# EAGLE design level-shift rpi-atmel (EAGLE 6.4)
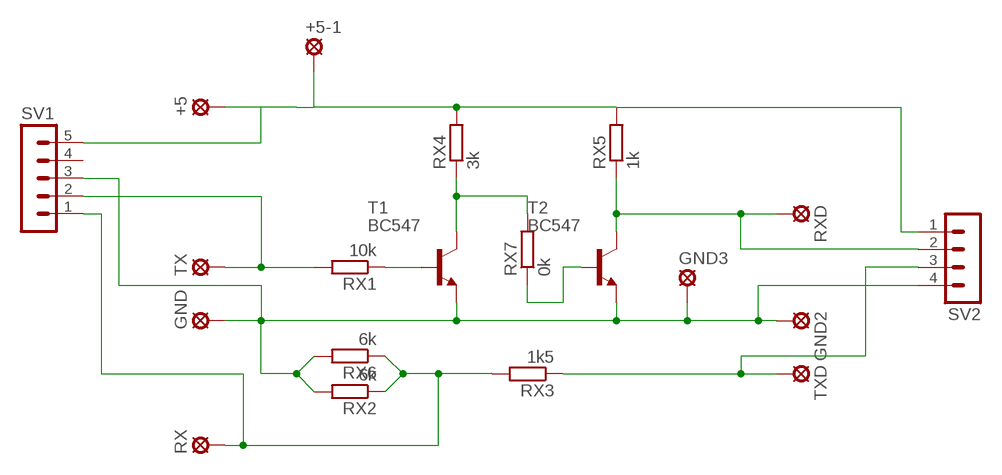
[diagram p0: schematic, sheet 1]

## Parts
+5  LSP10  [LSP10]
+5-1  LSP10  [LSP10]
GND  LSP10  [LSP10]
GND2  LSP10  [LSP10]
GND3  LSP10  [LSP10]
RX  LSP10  [LSP10]
RX1  10k  R-EU_0204/5  [0204/5]
RX2  6k  R-EU_0207/5V  [0207/5V]
RX3  1k5  R-EU_0207/5V  [0207/5V]
RX4  3k  R-EU_0207/7  [0207/7]
RX5  1k  R-EU_0204/7  [0204/7]
RX6  6k  R-EU_0207/5V  [0207/5V]
RX7  0k  R-EU_0204/5  [0204/5]
RXD  LSP10  [LSP10]
SV1  MA05-1  [MA05-1]
SV2  MA04-1  [MA04-1]
T1  BC547  [TO92]
T2  BC547  [TO92]
TX  LSP10  [LSP10]
TXD  LSP10  [LSP10]

## Nets
N$1: RX1.1 T1.2(B)
N$2: RX7.1 T2.2(B)
N$3: RX5.1 RXD.MP SV2.2 T2.3(C)
N$4: RX4.1 RX7.2 T1.3(C)
N$5: GND2.MP GND3.MP GND.MP RX2.2 RX6.2 SV1.3 SV2.4 T1.1(E) T2.1(E)
N$6: RX2.1 RX3.2 RX6.1 RX.MP SV1.1
N$7: +5-1.MP +5.MP RX4.2 RX5.2 SV1.5 SV2.1
N$9: RX1.2 SV1.2 TX.MP
N$11: RX3.1 SV2.3 TXD.MP
Unconnected: SV1.4

## Library data of the parts
+5 +5-1 GND GND2 GND3 RX RXD TX TXD = solpad:LSP10: SOLDER PAD drill 1.0 mm, distributor Buerklin, 12H555
RX1-RX7 = rcl:R-EU_: RESISTOR, European symbol
SV1 = con-lstb:MA05-1: PIN HEADER; OC_FARNELL: unknown; OC_NEWARK: unknown
SV2 = con-lstb:MA04-1: PIN HEADER; OC_FARNELL: unknown; OC_NEWARK: unknown
T1 T2 = transistor:BC547: NPN TRANSISTOR

## Board
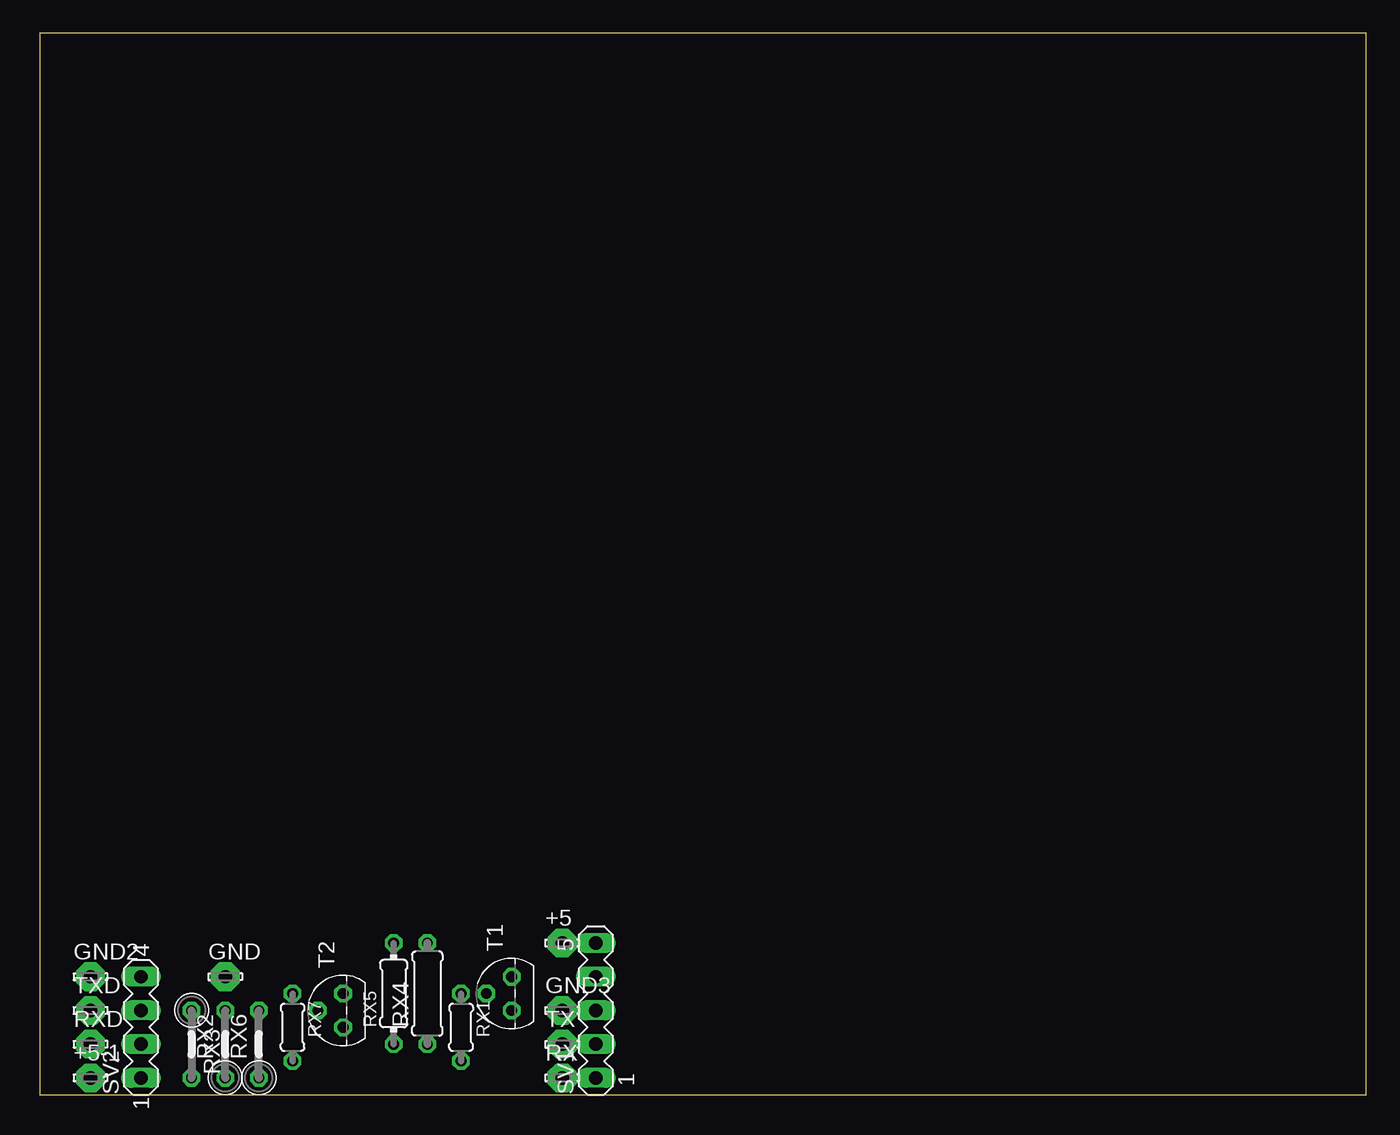
[diagram p1: board, top side]
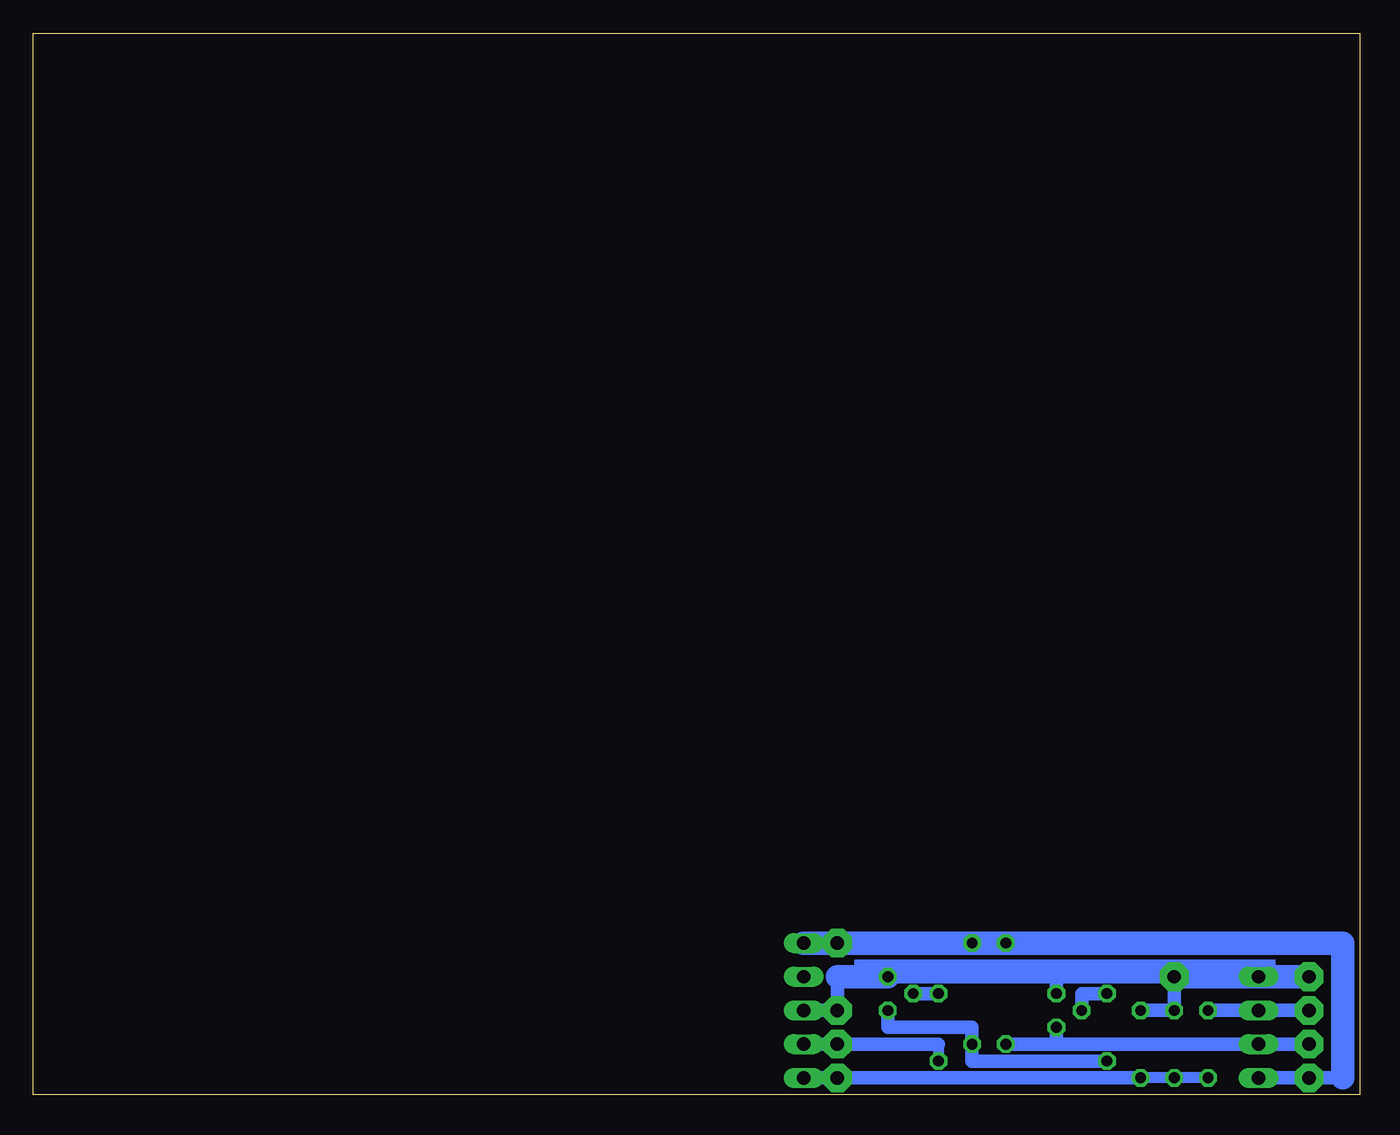
[diagram p2: board, bottom side, seen from below]

Size 100 x 80 mm. Coordinates in mm from the lower left corner, seen from the top.
Outline: 0,0 100,0 100,80 0,80 0,0
Copper layers (1*16): Top 0.035mm / dielectric 1.5mm / Bottom 0.035mm
Design rules "default": minimum track width 10mil, minimum drill 24mil, track to track 8mil, track to pad 8mil, pad to pad 8mil, via to via 8mil, smd to smd 8mil, copper to edge 40mil, drill to drill 8mil, minimum pad ring 10mil, minimum via ring 8mil, stop-mask expansion 4mil, vias tented up to drill 0mil, thermal gap 10mil

### Footprints (pad centres in the part's own frame; a part is rotated, then mirrored left to right if it is on the bottom)
LSP10 = drill 1.016 pad 2.159 octagon: MP 0,0
0204/5 = drill 0.813 octagon: 1 -2.54,0; 2 2.54,0
0207/5V = drill 0.813 octagon: 1 -2.54,0; 2 2.54,0
0207/7 = drill 0.813 octagon: 1 -3.81,0; 2 3.81,0
0204/7 = drill 0.813 octagon: 1 -3.81,0; 2 3.81,0
MA05-1 = drill 1.016 long: 1 -5.08,0; 2 -2.54,0; 3 0,0; 4 2.54,0; 5 5.08,0
MA04-1 = drill 1.016 long: 1 -3.81,0; 2 -1.27,0; 3 1.27,0; 4 3.81,0
TO92 = drill 0.813 octagon: 1 1.27,0; 2 0,1.905; 3 -1.27,0

### Placement (x,y rotation side)
+5  39.37,11.43 0 top
+5-1  3.81,1.27 0 top
GND  13.97,8.89 0 top
GND2  3.81,8.89 0 top
GND3  39.37,6.35 0 top
RX  39.37,1.27 0 top
RX1  31.75,5.08 270 top
RX2  13.97,3.81 90 top
RX3  11.43,3.81 270 top
RX4  29.21,7.62 90 top
RX5  26.67,7.62 90 top
RX6  16.51,3.81 90 top
RX7  19.05,5.08 270 top
RXD  3.81,3.81 0 top
SV1  41.91,6.35 90 top
SV2  7.62,5.08 90 top
T1  35.56,7.62 90 top
T2  22.86,6.35 90 top
TX  39.37,3.81 0 top
TXD  3.81,6.35 0 top

### Tracks (layer width: path | path; a pad name or v marks a point on that pad's centre or on a via)
N$1
  Bottom 1.016: RX1.1 T1.2
N$2
  Bottom 1.016: RX7.1 20.95,7.62 T2.2
N$3
  Bottom 1.016: RXD.MP SV2.2 22.86,3.81 | T2.3 22.86,3.81 | 22.86,3.81 RX5.1
N$4
  Bottom 1.016: T1.3 35.56,5.08 29.21,5.08 RX4.1 29.21,2.54 RX7.2
N$5
  Bottom 1.016: T1.1 22.86,8.89 | T2.1 22.86,8.89 | 22.86,8.89 GND.MP RX2.2 RX6.2 | 39.37,8.89 GND3.MP SV1.3
  Bottom 1.778: GND2.MP SV2.4 GND.MP | T1.1 39.37,8.89
N$6
  Bottom 0.813: RX3.2 RX2.1 RX6.1
  Bottom 1.016: RX6.1 RX.MP SV1.1
N$7
  Bottom 1.016: +5-1.MP SV2.1 1.27,1.27
  Bottom 1.778: 1.27,1.27 1.27,11.43 RX5.2 RX4.2 +5.MP SV1.5
N$9
  Bottom 0.813: 31.75,3.81 RX1.2
  Bottom 1.016: 31.75,3.81 TX.MP SV1.2
N$11
  Bottom 1.016: RX3.1 SV2.3 TXD.MP
(copper drawn outside any net)
  shapes: Bottom area x2